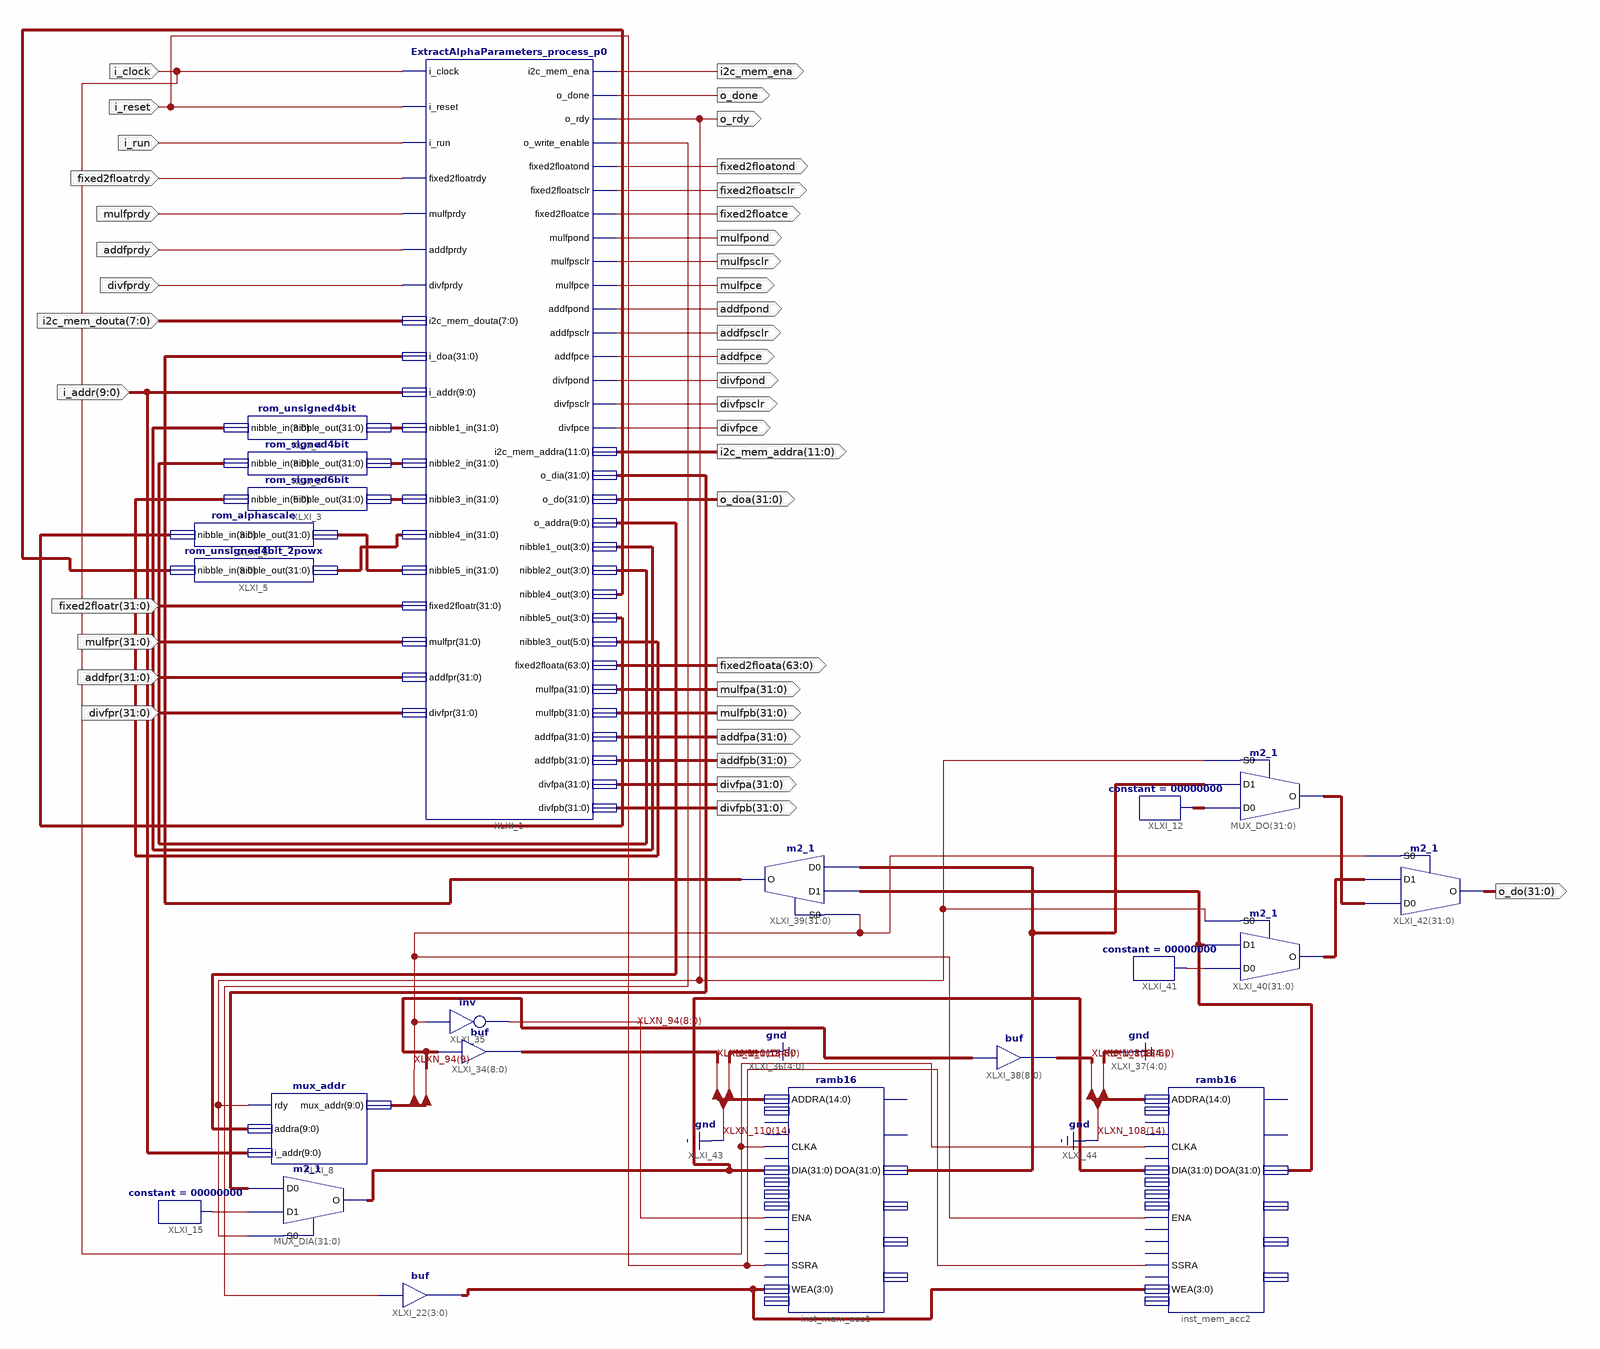
[diagram p0: schematic sheet 1]
// Xilinx ISE schematic ExtractAlphaParameters.sch (virtex4) as structural Verilog: 21 symbols, 38 ports
module ExtractAlphaParameters (
  input  [9:0] i_addr,
  input  i_clock,
  input  i_reset,
  input  i_run,
  input  fixed2floatrdy,
  input  mulfprdy,
  input  addfprdy,
  input  divfprdy,
  input  [7:0] i2c_mem_douta,
  input  [31:0] fixed2floatr,
  input  [31:0] mulfpr,
  input  [31:0] addfpr,
  input  [31:0] divfpr,
  output o_rdy,
  output i2c_mem_ena,
  output o_done,
  output fixed2floatond,
  output fixed2floatsclr,
  output fixed2floatce,
  output mulfpond,
  output mulfpsclr,
  output mulfpce,
  output addfpond,
  output addfpsclr,
  output addfpce,
  output divfpond,
  output divfpsclr,
  output divfpce,
  output [11:0] i2c_mem_addra,
  output [31:0] o_doa,
  output [63:0] fixed2floata,
  output [31:0] mulfpa,
  output [31:0] mulfpb,
  output [31:0] addfpa,
  output [31:0] addfpb,
  output [31:0] divfpa,
  output [31:0] divfpb,
  output [31:0] o_do
);

  wire o_write_enable, XLXN_37, XLXN_98, XLXN_116;
  wire [3:0] XLXN_6, XLXN_7, XLXN_8, XLXN_9, XLXN_78;
  wire [5:0] XLXN_10;
  wire [9:0] XLXN_26, XLXN_94;
  wire [13:5] XLXN_108, XLXN_110;
  wire [31:0] XLXN_1, XLXN_2, XLXN_3, XLXN_20, XLXN_21, XLXN_35, XLXN_38, XLXN_114, XLXN_117, XLXN_118,
       XLXN_119, XLXN_141, XLXN_142;

  ExtractAlphaParameters_process_p0 XLXI_1 (
    .i_clock(i_clock), .i_reset(i_reset), .i_run(i_run), .fixed2floatrdy(fixed2floatrdy),
    .mulfprdy(mulfprdy), .addfprdy(addfprdy), .divfprdy(divfprdy), .i2c_mem_douta(i2c_mem_douta),
    .i_doa(XLXN_21), .i_addr(i_addr), .nibble1_in(XLXN_1), .nibble2_in(XLXN_2), .nibble3_in(XLXN_3),
    .nibble4_in(XLXN_141), .nibble5_in(XLXN_142), .fixed2floatr(fixed2floatr), .mulfpr(mulfpr),
    .addfpr(addfpr), .divfpr(divfpr), .i2c_mem_ena(i2c_mem_ena), .o_done(o_done), .o_rdy(o_rdy),
    .o_write_enable(o_write_enable), .fixed2floatond(fixed2floatond), .fixed2floatsclr(fixed2floatsclr),
    .fixed2floatce(fixed2floatce), .mulfpond(mulfpond), .mulfpsclr(mulfpsclr), .mulfpce(mulfpce),
    .addfpond(addfpond), .addfpsclr(addfpsclr), .addfpce(addfpce), .divfpond(divfpond),
    .divfpsclr(divfpsclr), .divfpce(divfpce), .i2c_mem_addra(i2c_mem_addra), .o_dia(XLXN_38), .o_do(o_doa),
    .o_addra(XLXN_26), .nibble1_out(XLXN_6), .nibble2_out(XLXN_7), .nibble4_out(XLXN_8),
    .nibble5_out(XLXN_9), .nibble3_out(XLXN_10), .fixed2floata(fixed2floata), .mulfpa(mulfpa),
    .mulfpb(mulfpb), .addfpa(addfpa), .addfpb(addfpb), .divfpa(divfpa), .divfpb(divfpb));
  rom_unsigned4bit XLXI_4 (.nibble_in(XLXN_6), .nibble_out(XLXN_1));
  rom_signed4bit XLXI_2 (.nibble_in(XLXN_7), .nibble_out(XLXN_2));
  rom_signed6bit XLXI_3 (.nibble_in(XLXN_10), .nibble_out(XLXN_3));
  rom_alphascale XLXI_6 (.nibble_in(XLXN_9), .nibble_out(XLXN_142));
  rom_unsigned4bit_2powx XLXI_5 (.nibble_in(XLXN_8), .nibble_out(XLXN_141));
  ramb16 #(.WRITE_WIDTH_B(36), .WRITE_WIDTH_A(36), .WRITE_MODE_B("READ_FIRST"), .WRITE_MODE_A("READ_FIRST"), .READ_WIDTH_B(36), .READ_WIDTH_A(36)) inst_mem_acc1 (
    .ADDRA({1'b0, XLXN_110, {5{1'b0}}}), .CLKA(i_clock), .DIA(XLXN_35), .ENA(XLXN_98), .SSRA(i_reset),
    .WEA(XLXN_78), .DOA(XLXN_114));  // open: ADDRB, CASCADEINA, CASCADEINB, CLKB, DIB, DIPA, DIPB, REGCEA, REGCEB, ENB, SSRB, WEB, CASCADEOUTA, CASCADEOUTB, DOB, DOPA, DOPB
  mux_addr XLXI_8 (.rdy(o_rdy), .addra(XLXN_26), .i_addr(i_addr), .mux_addr(XLXN_94));
  m2_1 MUX_DIA[31:0] (.D0(XLXN_38), .D1(XLXN_37), .S0(o_rdy), .O(XLXN_35));
  constant #(.CValue("00000000")) XLXI_15 (.O(XLXN_37));
  assign XLXN_78 = {4{o_write_enable}};  // buf XLXI_22[3..0], 4 bits wide
  m2_1 MUX_DO[31:0] (.D0(XLXN_20), .D1(XLXN_114), .S0(o_rdy), .O(XLXN_118));
  constant #(.CValue("00000000")) XLXI_12 (.O(XLXN_20));
  ramb16 #(.WRITE_WIDTH_B(36), .WRITE_WIDTH_A(36), .WRITE_MODE_B("READ_FIRST"), .WRITE_MODE_A("READ_FIRST"), .READ_WIDTH_B(36), .READ_WIDTH_A(36)) inst_mem_acc2 (
    .ADDRA({1'b0, XLXN_108, {5{1'b0}}}), .CLKA(i_clock), .DIA(XLXN_35), .ENA(XLXN_94[9]), .SSRA(i_reset),
    .WEA(XLXN_78), .DOA(XLXN_117));  // open: ADDRB, CASCADEINA, CASCADEINB, CLKB, DIB, DIPA, DIPB, REGCEA, REGCEB, ENB, SSRB, WEB, CASCADEOUTA, CASCADEOUTB, DOB, DOPA, DOPB
  assign XLXN_110 = XLXN_94[8:0];  // buf XLXI_34[8..0], 9 bits wide
  not XLXI_35 (XLXN_98, XLXN_94[9]);
  assign XLXN_108 = XLXN_94[8:0];  // buf XLXI_38[8..0], 9 bits wide
  m2_1 XLXI_39[31:0] (.D0(XLXN_114), .D1(XLXN_117), .S0(XLXN_94[9]), .O(XLXN_21));
  m2_1 XLXI_40[31:0] (.D0(XLXN_116), .D1(XLXN_117), .S0(o_rdy), .O(XLXN_119));
  constant #(.CValue("00000000")) XLXI_41 (.O(XLXN_116));
  m2_1 XLXI_42[31:0] (.D0(XLXN_118), .D1(XLXN_119), .S0(XLXN_94[9]), .O(o_do));
endmodule
